# EasyEDA schematic SCH_Badur Gaddi v0.1.5.json
TITLE: Baddur Gaddi Schematics; REV: 0.1.5; Date: 2021-10-06; Sheet: 1/1; Drawn By: Tausif Samin; Company: Team Prodigy
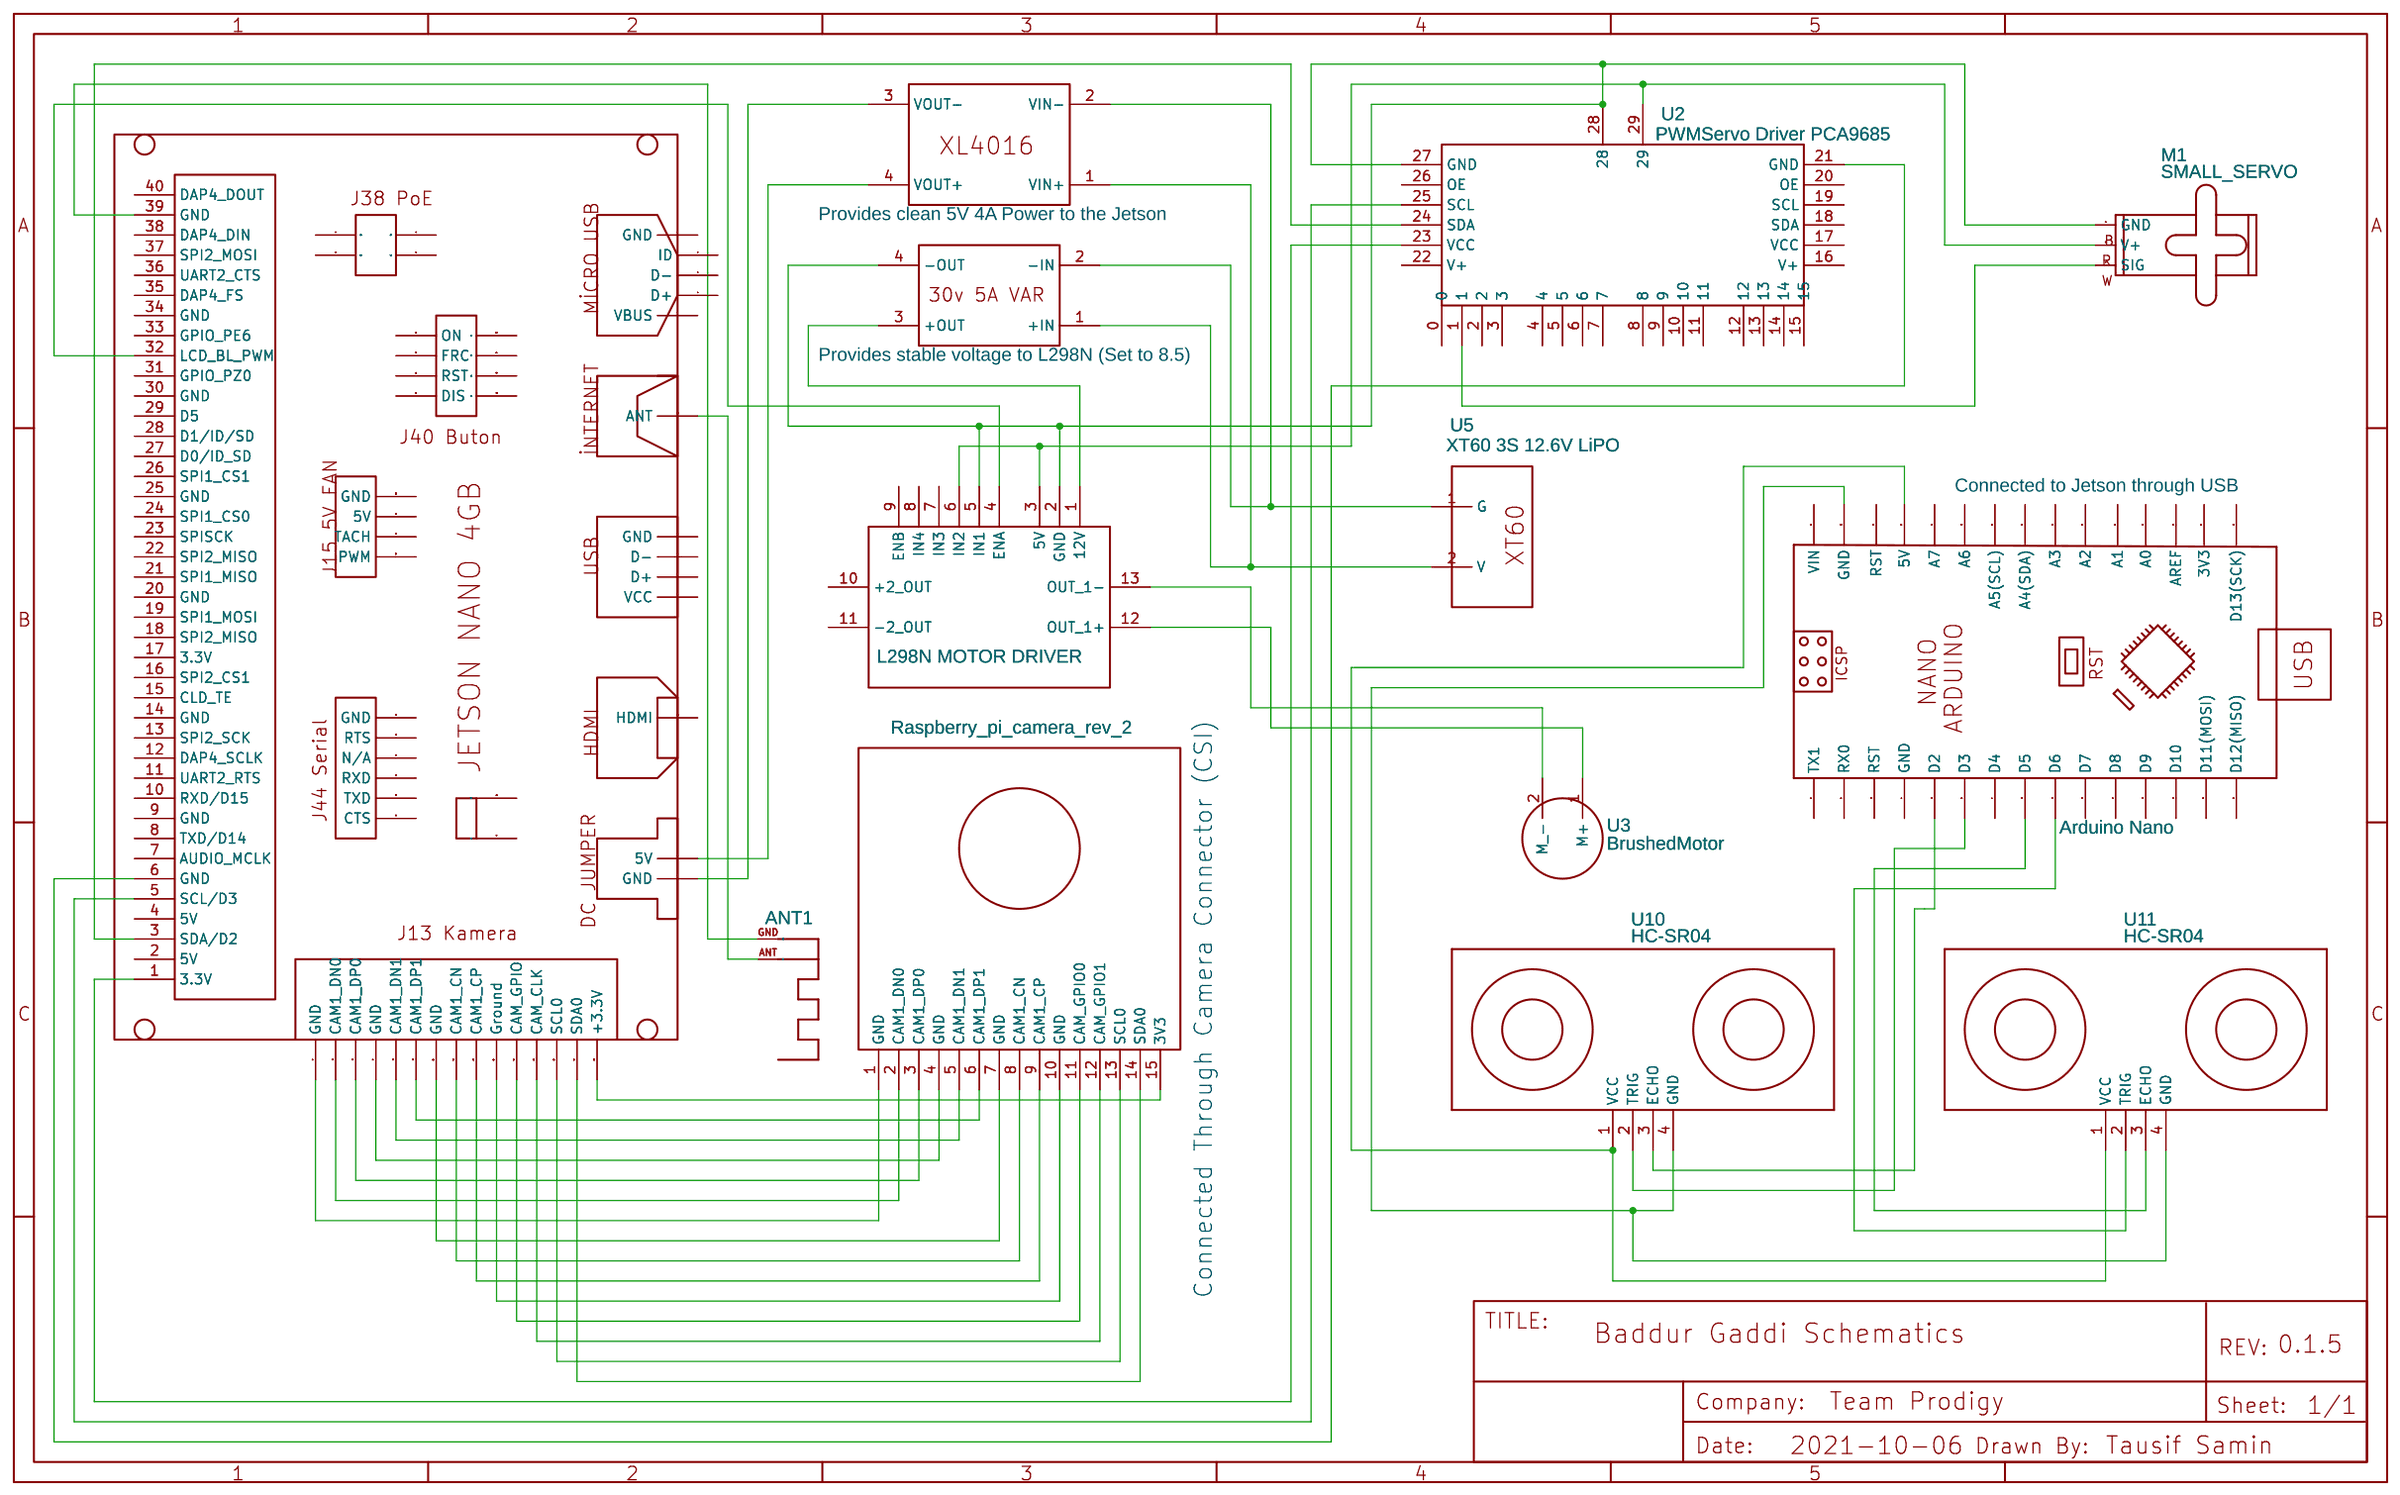
[diagram p0: schematic sheet]

## Parts
ANT1  ANTENNA_WIFI_MIFA  [WIFI ANTENNA MIFA INVERTED F ANTENNA]
M1  SMALL_SERVO  [1X03]
MODULE1  L298N MOTOR DRIVER  [L298N NI]
U1  XL4016  [XL4016-37X60]
U2  PWMServo Driver PCA9685  [16-CHANNEL 12-BIT PWM/SERVO DRIVER - I2C - PCA9685]
U3  BrushedMotor  [BRUSHED_MOTOR]
U4  Arduino Nano  [ARDUINO-NANO-SLS]
U5  XT60 3S 12.6V LiPO  [XT60]
U6  jetson nano
U7  Raspberry_pi_camera_rev_2
U9  XL4015 PS 5A  [XL4015 PS 5A]
U10  HC-SR04  [HC-SR04]
U11  HC-SR04  [HC-SR04]

## Library data of the parts
ANT1 = ANTENNA_WIFI_MIFA: Contributor: Schinken
M1 = SMALL_SERVO: Small servo motor; Contributor: SparkFun
MODULE1 = L298N MOTOR DRIVER N: Contributor: Nihal Das
U1 = XL4016: Contributor: pbarnier
U2 = PWMServo Driver PCA9685: Manufacturer: Adafruit; Manufacturer Part: 815; Supplier: Adafruit; Supplier Part: 16-Channel 12-bit PWMServo Driver PCA9685; link: https://www.adafruit.com/product/815; Contributor: Sheldon250
U3 = BrushedMotor: Contributor: wasserwiesel
U4 = Arduino Nano: Contributor: Robert Rozwadowski
U5 = XT60: Contributor: Drone_H2EA
U6 = jetson nano: Contributor: mhakcesme
U7 = Raspberry_pi_camera_rev_1.3: Contributor: robinvonk789
U9 = XL4015 PS 5A: Supplier Part: XL4005; Contributor: nuge61
U10 U11 = HC-SR04: Ultrasonic Ranging Module HC-SR04; Contributor: adrirobot

## Nets
Net-(ANT1-ANT): ANT1.ANT U6.ETHERNET(HDMI)
Net-(ANT1-GND): ANT1.GND U6.39(GND)
Net-(M1-1): M1.1(SIG) U2.1
Net-(M1-2): M1.2(V+) MODULE1.3(5V) MODULE1.6(IN2) U2.29
Net-(M1-3): M1.3(GND) MODULE1.2(GND) MODULE1.5(IN1) U2.27(GND) U2.28 U9.4(-OUT)
Net-(MODULE1-1): MODULE1.1(12V) U9.3(+OUT)
Net-(MODULE1-4): MODULE1.4(ENA) U6.32(LCD_BL_PWM)
Net-(MODULE1-12): MODULE1.12(OUT_1+) U3.1(M+)
Net-(MODULE1-13): MODULE1.13(OUT_1-) U3.2(M -)
Net-(U1-1): U1.1(VIN+) U5.2(V) U9.1(+IN)
Net-(U1-2): U1.2(VIN-) U5.1(G) U9.2(-IN)
Net-(U1-3): U1.3(VOUT-) U6.61(GND)
Net-(U1-4): U1.4(VOUT+) U6.62(5V)
Net-(U2-21): U2.21(GND) U6.6(GND)
Net-(U2-23): U2.23(VCC) U6.1(3.3V)
Net-(U2-24): U2.24(SDA) U6.3(SDA/D2)
Net-(U2-25): U2.25(SCL) U6.5(SCL/D3)
Net-(U4-5): U4.5(D2) U10.3(ECHO)
Net-(U4-6): U4.6(D3) U10.2(TRIG)
Net-(U4-8): U4.8(D5) U11.3(ECHO)
Net-(U4-9): U4.9(D6) U11.2(TRIG)
Net-(U4-27): U4.27(5V) U10.1(VCC) U11.1(VCC)
Net-(U4-29): U4.29(GND) U10.4(GND) U11.4(GND)
Net-(U6-74): U6.74(GND) U7.1(GND)
Net-(U6-75): U6.75(CAM1_DN0) U7.2(CAM1_DN0)
Net-(U6-76): U6.76(CAM1_DP0) U7.3(CAM1_DP0)
Net-(U6-77): U6.77(GND) U7.4(GND)
Net-(U6-78): U6.78(CAM1_DN1) U7.5(CAM1_DN1)
Net-(U6-79): U6.79(CAM1_DP1) U7.6(CAM1_DP1)
Net-(U6-80): U6.80(GND) U7.7(GND)
Net-(U6-81): U6.81(CAM1_CN) U7.8(CAM1_CN)
Net-(U6-82): U6.82(CAM1_CP) U7.9(CAM1_CP)
Net-(U6-83): U6.83(Ground) U7.10(GND)
Net-(U6-84): U6.84(CAM_GPIO) U7.11(CAM_GPIO0)
Net-(U6-85): U6.85(CAM_CLK) U7.12(CAM_GPIO1)
Net-(U6-86): U6.86(SCL0) U7.13(SCL0)
Net-(U6-87): U6.87(SDA0) U7.14(SDA0)
Net-(U6-88): U6.88(+3.3V) U7.15(3V3)

Not connected (* = marked no-connect by the designer): MODULE1 7(IN3) 8(IN4) 9(ENB) 10(+2_OUT) 11(-2_OUT); U2 0 2 3 4 5 6 7 8 9 10 11 12 13 14 15 16(V+) 17(VCC) 18(SDA) 19(SCL) 20(OE) 22(V+) 26(OE); U4 1(TX1) 2(RX0) 3(RST) 4(GND) 7(D4) 10(D7) 11(D8) 12(D9) 13(D10) 14(D11(MOSI)) 15(D12(MISO)) 16(D13(SCK)) 17(3V3) 18(AREF) 19(A0) 20(A1) 21(A2) 22(A3) 23(A4(SDA)) 24(A5(SCL)) 25(A6) 26(A7) 28(RST) 30(VIN); U6 2(5V) 4(5V) 7(AUDIO_MCLK) 8(TXD/D14) 9(GND) 10(RXD/D15) 11(UART2_RTS) 12(DAP4_SCLK) 13(SPI2_SCK) 14(GND) 15(CLD_TE) 16(SPI2_CS1) 17(3.3V) 18(SPI2_MISO) 19(SPI1_MOSI) 20(GND) 21(SPI1_MISO) 22(SPI2_MISO) 23(SPISCK) 24(SPI1_CS0) 25(GND) 26(SPI1_CS1) 27(D0/ID_SD) 28(D1/ID/SD) 29(D5) 30(GND) 31(GPIO_PZ0) 33(GPIO_PE6) 34(GND) 35(DAP4_FS) 36(UART2_CTS) 37(SPI2_MOSI) 38(DAP4_DIN) 40(DAP4_DOUT) 41(CTS) 42(TXD) 43(RXD) 44(N/A) 45(RTS) 46(GND) 47 48 49 50 51 52 53(ON) 54(FRC) 55(RST) 56(DIS) 57(PWM) 58(TACH) 59(5V) 60(GND) 70(VCC) 71(D+) 72(D-) 73(GND) .(GND)

## Notes on the sheet
- Provides clean 5V 4A Power to the Jetson
- Provides stable voltage to L298N (Set to 8.5)
- Connected to Jetson through USB
- Connected Through Camera Connector (CSI)
